# EAGLE design quadruped (EAGLE 6.2)
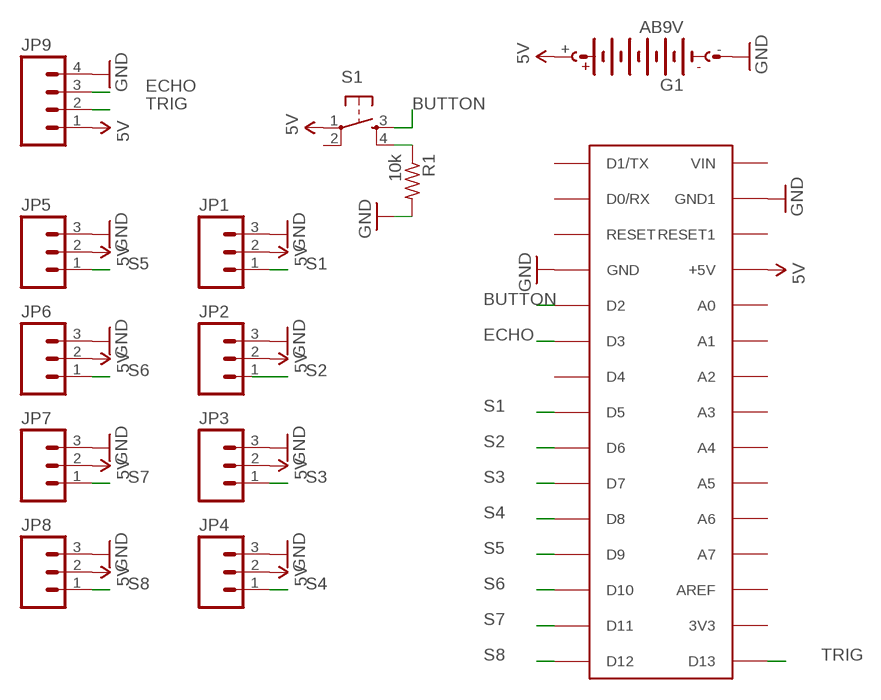
[diagram p0: schematic, sheet 1]

## Parts
G1  AB9V  [AB9V]
JP1  M03PTH  [1X03]
JP2  M03PTH  [1X03]
JP3  M03PTH  [1X03]
JP4  M03PTH  [1X03]
JP5  M03PTH  [1X03]
JP6  M03PTH  [1X03]
JP7  M03PTH  [1X03]
JP8  M03PTH  [1X03]
JP9  M04PTH  [1X04]
R1  10k  R-US_0204/7  [0204/7]
S1  TAC_SWITCHPTH  [TACTILE-PTH]
U$1  ARDUINONANO  [PDIP-32]

## Nets
5V: G1.+ JP1.2 JP2.2 JP3.2 JP4.2 JP5.2 JP6.2 JP7.2 JP8.2 JP9.1 S1.1 U$1.+5V
BUTTON: S1.3 U$1.D2
ECHO: JP9.3 U$1.D3
GND: G1.- JP1.3 JP2.3 JP3.3 JP4.3 JP5.3 JP6.3 JP7.3 JP8.3 JP9.4 R1.2 U$1.GND U$1.GND1
N$1: R1.1 S1.4
S1: JP1.1 U$1.D5
S2: JP2.1 U$1.D6
S3: JP3.1 U$1.D7
S4: JP4.1 U$1.D8
S5: JP5.1 U$1.D9
S6: JP6.1 U$1.D10
S7: JP7.1 U$1.D11
S8: JP8.1 U$1.D12
TRIG: JP9.2 U$1.D13
Unconnected: S1.2 U$1.3V3 U$1.A0 U$1.A1 U$1.A2 U$1.A3 U$1.A4 U$1.A5 U$1.A6 U$1.A7 U$1.AREF U$1.D0/RX U$1.D1/TX U$1.D4 U$1.RESET U$1.RESET1 U$1.VIN

## Library data of the parts
G1 = battery:AB9V: 9-V BATTERY CLIP
JP1-JP8 = SparkFun:M03: Header 3 Standard 3-pin 0.1" header. Use with straight break away headers (SKU : PRT-00116), right angle break away headers (PRT-00553), swiss pins (PRT-00743), machine pins (PRT-00117), and female headers (PRT-00115). Molex polarized connector foot print use with SKU : PRT-08232 with associated crimp pins and housings.
JP9 = SparkFun:M04: Header 4 Standard 4-pin 0.1" header. Use with straight break away headers (SKU : PRT-00116), right angle break away headers (PRT-00553), swiss pins (PRT-00743), machine pins (PRT-00117), and female headers (PRT-00115). Molex polarized connector foot print use with SKU : PRT-08231 with associated crimp pins and housings. 1MM SMD Version SKU: PRT-10208
R1 = resistor:R-US_: RESISTOR, American symbol
S1 = SparkFun:TAC_SWITCH: Momentary Switch Button commonly used for reset or general input. Spark Fun Electronics SKU : COM-00097
U$1 = jet-lib:ARDUINONANO

## Net classes
0 default: width 0.381 mm

## Board
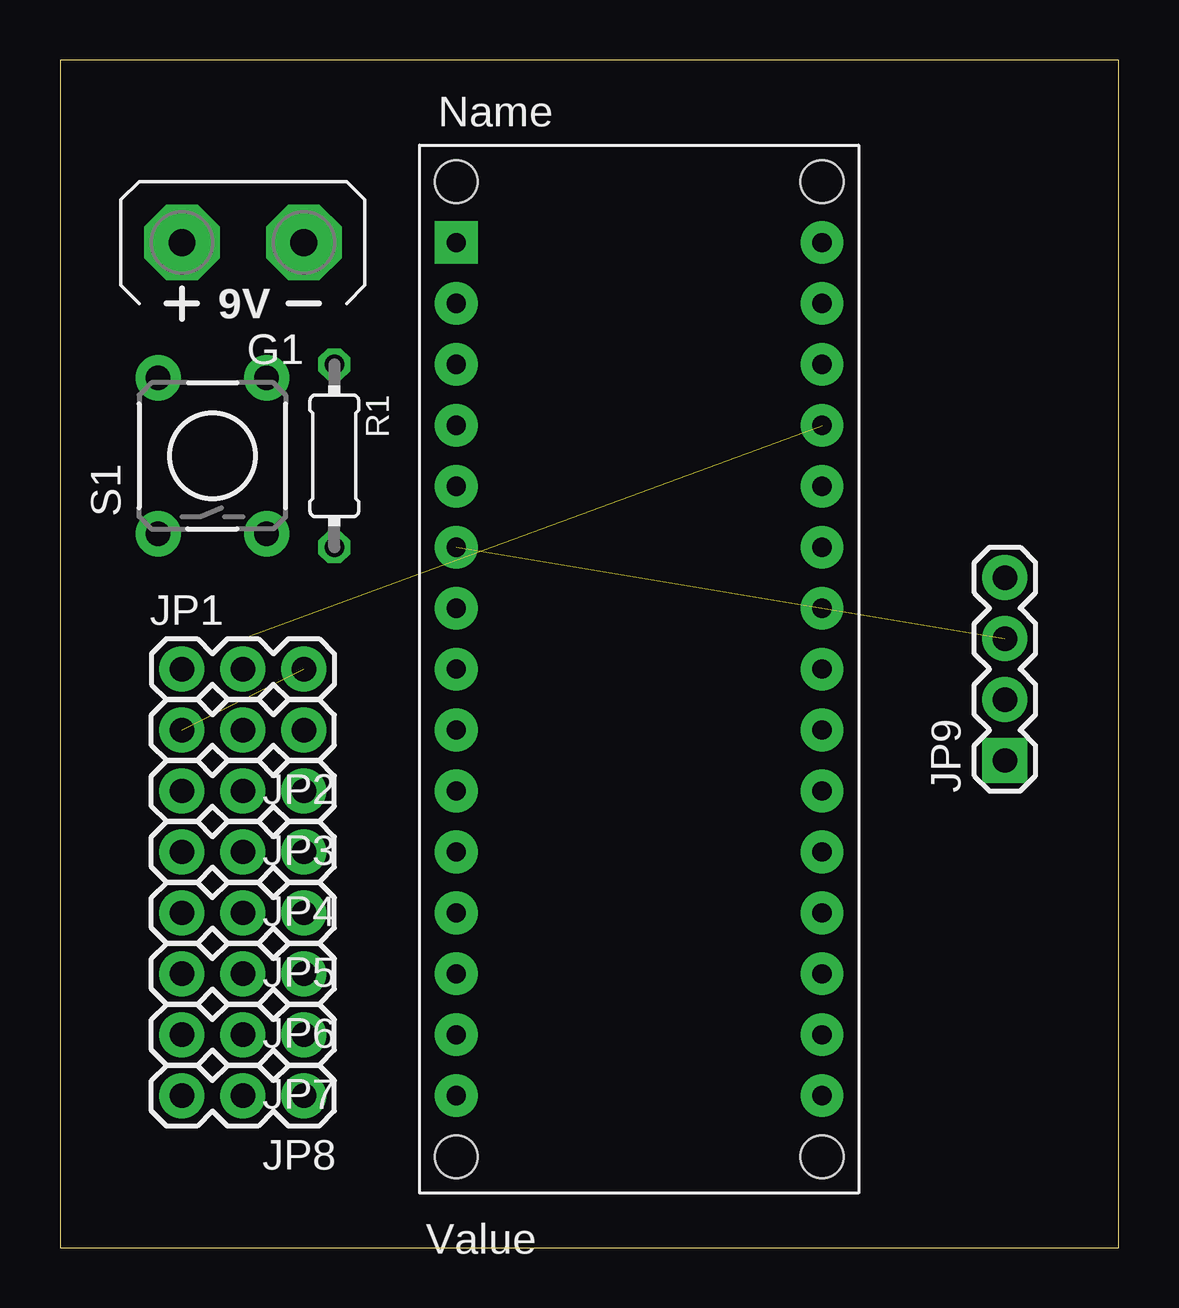
[diagram p1: board, top side]
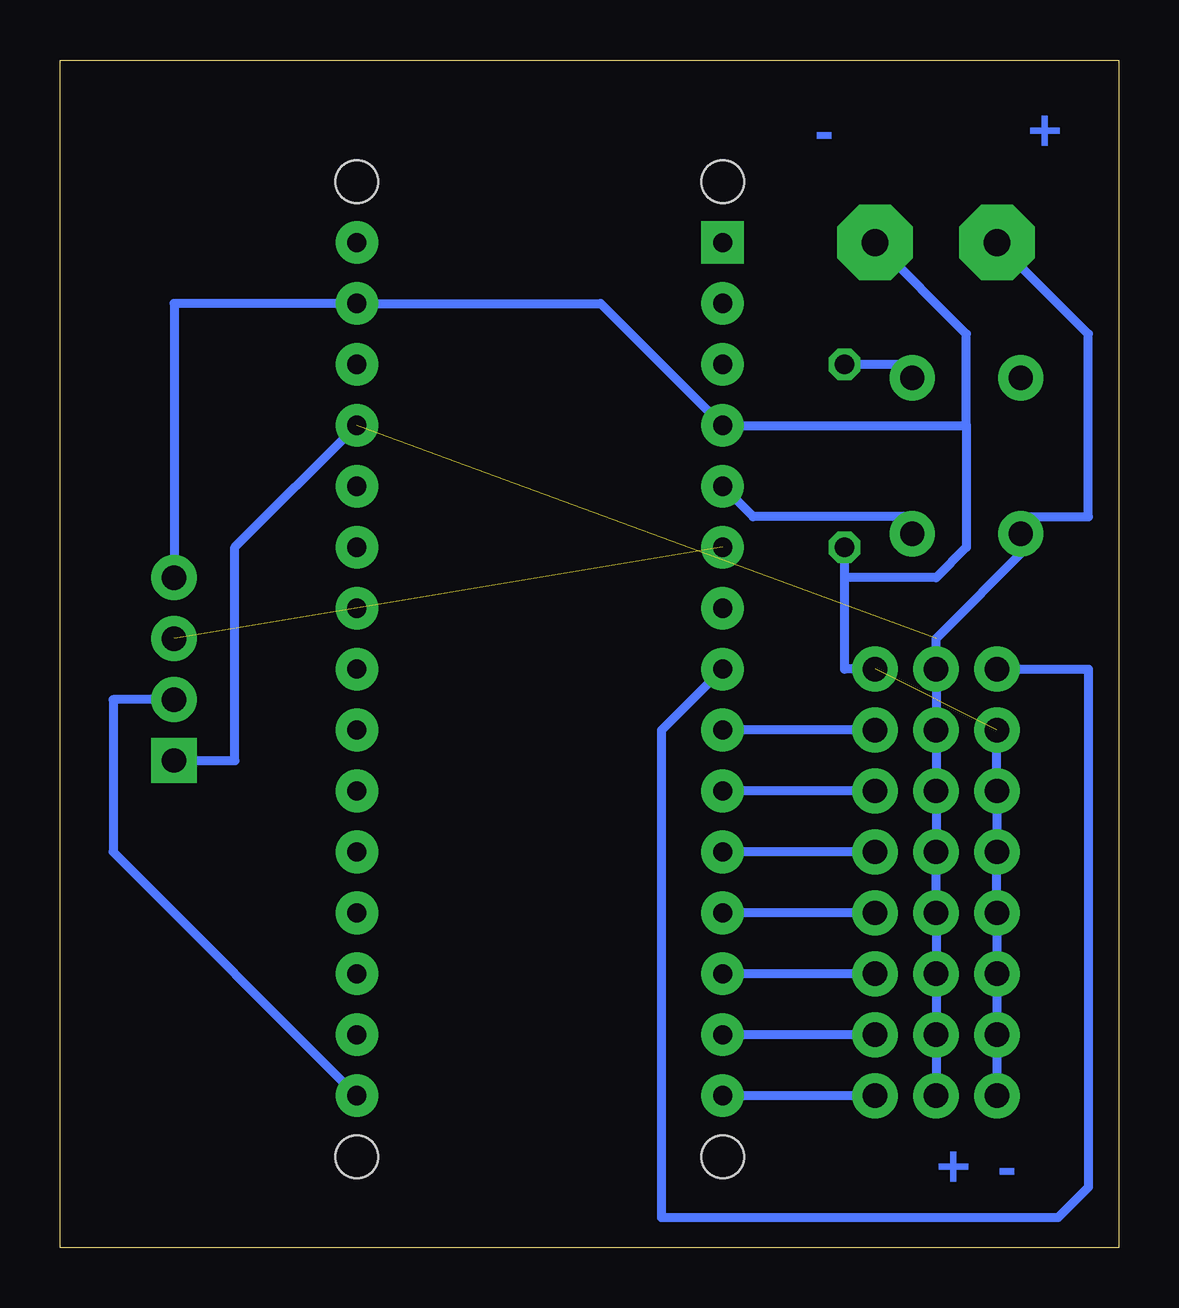
[diagram p2: board, bottom side, seen from below]

Size 44.12 x 49.52 mm. Coordinates in mm from the lower left corner, seen from the top.
Outline: 0,0 44.12,0 44.12,49.52 0,49.52 0,0
Copper layers (1*16): Top 0.035mm / dielectric 1.5mm / Bottom 0.035mm
Design rules: minimum track width 10mil, minimum drill 24mil, track to track 8mil, track to pad 8mil, pad to pad 8mil, via to via 8mil, smd to smd 8mil, copper to edge 40mil, drill to drill 8mil, minimum pad ring 10mil, minimum via ring 8mil, stop-mask expansion 4mil, vias tented up to drill 0mil, thermal gap 10mil

### Footprints (pad centres in the part's own frame; a part is rotated, then mirrored left to right if it is on the bottom)
AB9V = drill 1.118 pad 3.15 octagon: + 0,2.54; - 0,-2.54
1X03 = drill 1.016 pad 1.88: 1 0,0; 2 2.54,0; 3 5.08,0
1X04 = drill 1.016 pad 1.88 square: 1 0,0 | drill 1.016 pad 1.88: 2 2.54,0; 3 5.08,0; 4 7.62,0
0204/7 = drill 0.813 octagon: 1 -3.81,0; 2 3.81,0
TACTILE-PTH = drill 1.016 pad 1.88: 1 -3.251,2.261; 2 3.251,2.261; 3 -3.251,-2.261; 4 3.251,-2.261
PDIP-32 = drill 0.8 pad 1.778: 3V3 15.24,-35.56; +5V 15.24,-10.16; A0 15.24,-12.7; A1 15.24,-15.24; A2 15.24,-17.78; A3 15.24,-20.32; A4 15.24,-22.86; A5 15.24,-25.4; A6 15.24,-27.94; A7 15.24,-30.48; AREF 15.24,-33.02; D0/RX 0,-5.08; D2 0,-12.7; D3 0,-15.24; D4 0,-17.78; D5 0,-20.32; D6 0,-22.86; D7 0,-25.4; D8 0,-27.94; D9 0,-30.48; D10 0,-33.02; D11 0,-35.56; D12 0,-38.1; D13 15.24,-38.1; GND 0,-10.16; GND1 15.24,-5.08; RESET 0,-7.62; RESET1 15.24,-7.62; VIN 15.24,-2.54 | drill 0.8 pad 1.778 square: D1/TX 0,-2.54 | hole 1.778: 0,0; 0,-40.64; 15.24,-40.64; 15.24,0

### Placement (x,y rotation side)
G1  7.62,41.91 90 top
JP1  5.08,24.13 0 top
JP2  10.16,21.59 180 top
JP3  10.16,19.05 180 top
JP4  10.16,16.51 180 top
JP5  10.16,13.97 180 top
JP6  10.16,11.43 180 top
JP7  10.16,8.89 180 top
JP8  10.16,6.35 180 top
JP9  39.37,20.32 90 top
R1  11.43,33.02 270 top
S1  6.35,33.02 90 top
U$1  16.51,44.45 0 top

### Tracks (layer width: path | path; a pad name or v marks a point on that pad's centre or on a via)
5V  (1 unrouted)
  Bottom 0.381: U$1.+5V 36.83,29.21 36.83,20.32 JP9.1 | JP8.2 JP7.2 JP6.2 JP5.2 JP4.2 JP3.2 JP2.2 JP1.2 7.62,25.4 3.81,29.21 S1.1 3.81,30.48 1.27,30.48 1.27,38.1 G1.+
BUTTON
  Bottom 0.381: U$1.D2 15.24,30.48 8.89,30.48 S1.3
ECHO  (1 unrouted)
GND  (1 unrouted)
  Bottom 0.381: JP2.3 JP3.3 JP4.3 JP5.3 JP6.3 JP7.3 JP8.3 | 11.43,27.94 11.43,24.13 JP1.3 | 11.43,27.94 R1.2 | JP9.4 39.37,39.37 U$1.GND1 21.59,39.37 U$1.GND 6.35,34.29 | 11.43,27.94 7.62,27.94 6.35,29.21 6.35,34.29 | G1.- 6.35,38.1 6.35,34.29
N$1
  Bottom 0.381: R1.1 8.89,36.83 S1.4
S1
  Bottom 0.381: U$1.D5 19.05,21.59 19.05,1.27 2.54,1.27 1.27,2.54 1.27,24.13 JP1.1
S2
  Bottom 0.381: JP2.1 U$1.D6
S3
  Bottom 0.381: JP3.1 U$1.D7
S4
  Bottom 0.381: JP4.1 U$1.D8
S5
  Bottom 0.381: JP5.1 U$1.D9
S6
  Bottom 0.381: JP6.1 U$1.D10
S7
  Bottom 0.381: JP7.1 U$1.D11
S8
  Bottom 0.381: JP8.1 U$1.D12
TRIG
  Bottom 0.381: U$1.D13 41.91,16.51 41.91,22.86 JP9.2

### Text on the board
Bottom: + | - | - | +